# EAGLE design DAC2 (EAGLE 7.2.0)
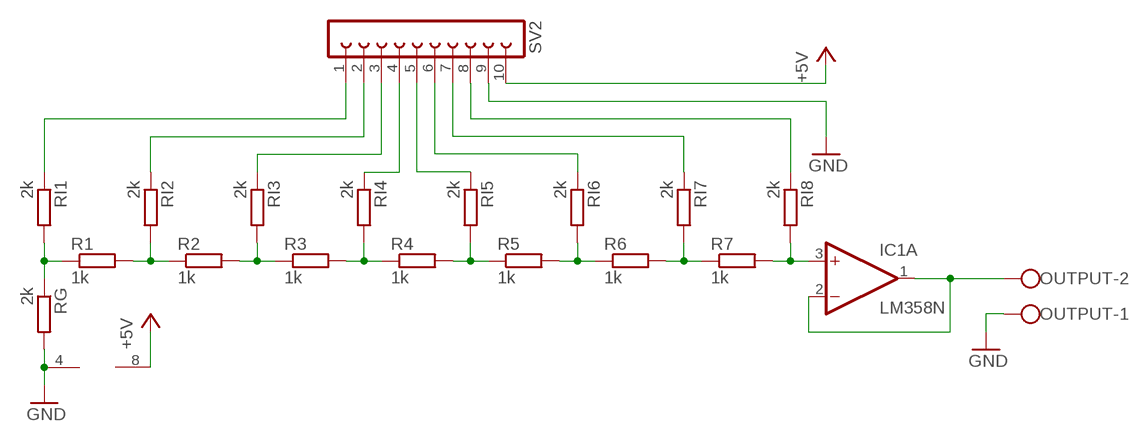
[diagram p0: schematic, sheet 1]

## Parts
IC1  LM358N  [DIL08]
OUTPUT  W237-102  [W237-102]
R1  1k  R-EU_0207/12  [0207/12]
R2  1k  R-EU_0207/12  [0207/12]
R3  1k  R-EU_0207/12  [0207/12]
R4  1k  R-EU_0207/12  [0207/12]
R5  1k  R-EU_0207/12  [0207/12]
R6  1k  R-EU_0207/12  [0207/12]
R7  1k  R-EU_0207/12  [0207/12]
RG  2k  R-EU_0207/12  [0207/12]
RI1  2k  R-EU_0207/12  [0207/12]
RI2  2k  R-EU_0207/12  [0207/12]
RI3  2k  R-EU_0207/12  [0207/12]
RI4  2k  R-EU_0207/12  [0207/12]
RI5  2k  R-EU_0207/12  [0207/12]
RI6  2k  R-EU_0207/12  [0207/12]
RI7  2k  R-EU_0207/12  [0207/12]
RI8  2k  R-EU_0207/12  [0207/12]
SV2  FE10-1  [FE10]

## Nets
+5V: IC1.8(P:V+) SV2.10
GND: IC1.4(P:V-) OUTPUT.1 RG.2 SV2.9
N$1: R1.1 RG.1 RI1.2
N$2: R1.2 R2.1 RI2.2
N$3: R2.2 R3.1 RI3.2
N$4: R3.2 R4.1 RI4.2
N$5: R4.2 R5.1 RI5.2
N$6: R5.2 R6.1 RI6.2
N$7: R6.2 R7.1 RI7.2
N$8: IC1.3(A:+IN) R7.2 RI8.2
N$9: IC1.1(A:OUT) IC1.2(A:-IN) OUTPUT.2
N$10: RI1.1 SV2.1
N$11: RI2.1 SV2.2
N$12: RI3.1 SV2.3
N$13: RI4.1 SV2.4
N$14: RI5.1 SV2.5
N$15: RI6.1 SV2.6
N$16: RI7.1 SV2.7
N$17: RI8.1 SV2.8
Unconnected: IC1.5(B:+IN) IC1.6(B:-IN) IC1.7(B:OUT)

## Library data of the parts
IC1 = linear:LM358: OP AMP also LM158; LM258; LM2904 Source: http://cache.national.com/ds/LM/LM158.pdf
OUTPUT = con-wago-500:W237-102: WAGO SCREW CLAMP; MPN: 237-102; OC_FARNELL: unknown; OC_NEWARK: 70K9898
R1-R7 RG RI1-RI8 = rcl:R-EU_: RESISTOR, European symbol
SV2 = con-lsta:FE10-1: FEMALE HEADER; OC_FARNELL: unknown; OC_NEWARK: unknown

## Board
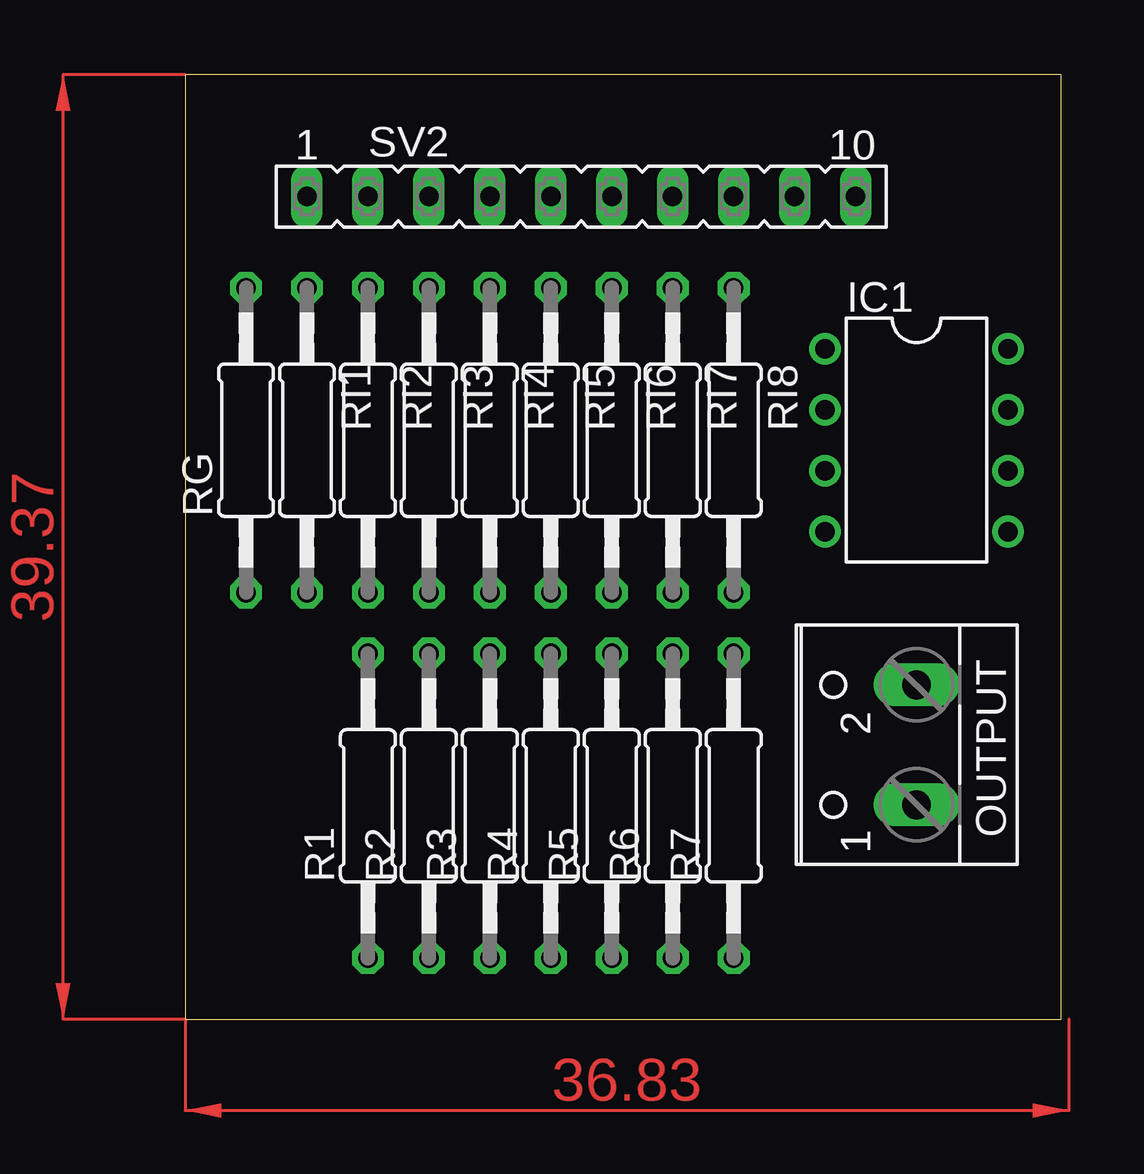
[diagram p1: board, top side]
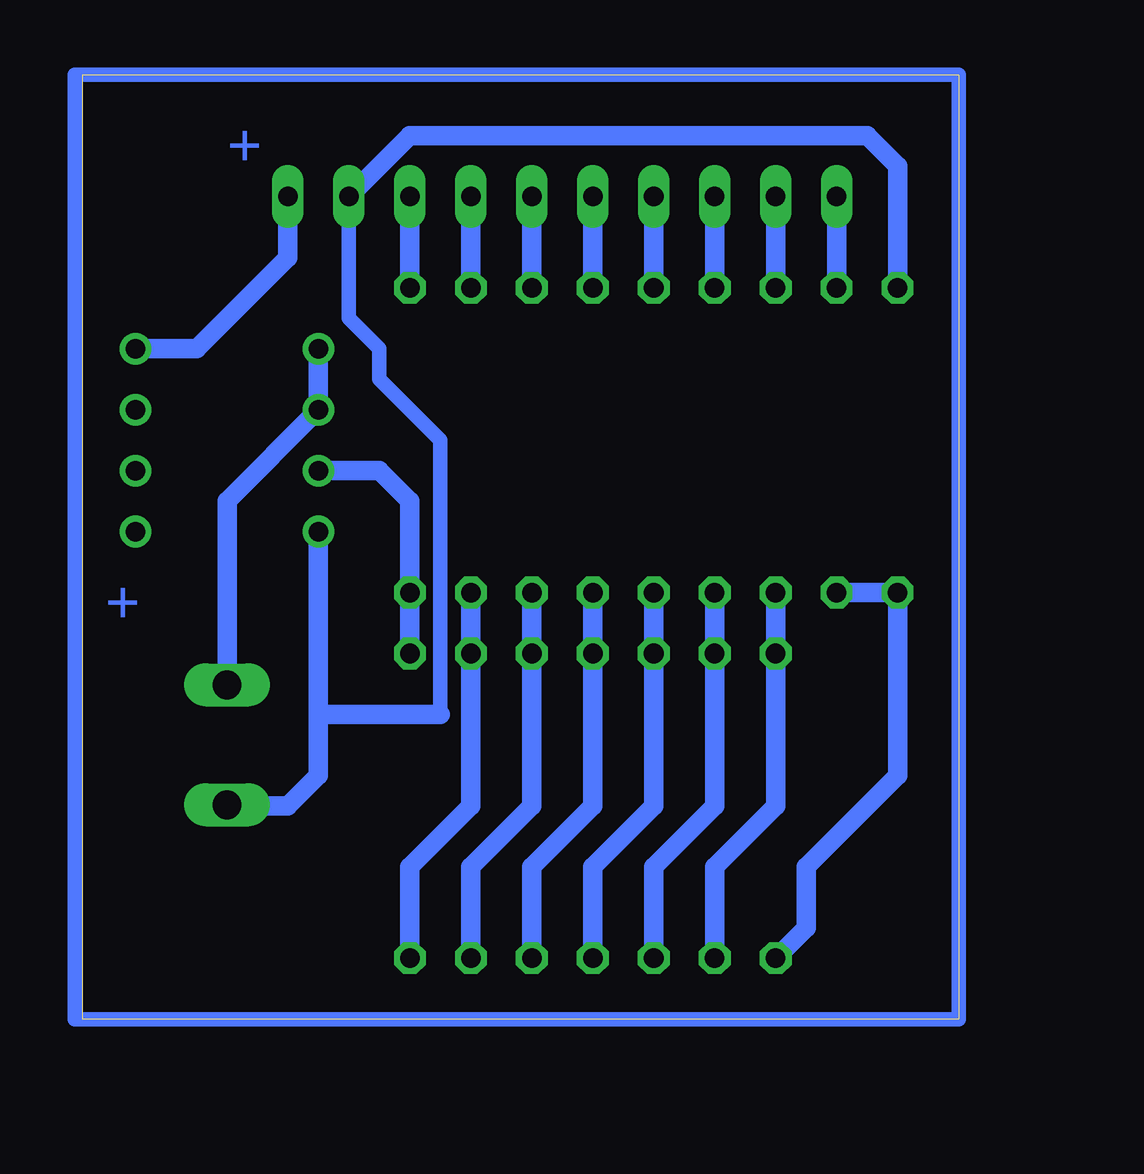
[diagram p2: board, bottom side, seen from below]

Size 36.5 x 39.36 mm. Coordinates in mm from the lower left corner, seen from the top.
Outline: 0,0 36.5,0 36.5,39.36 0,39.36 0,0
Copper layers (1*16): Top 0.035mm / dielectric 1.5mm / Bottom 0.035mm
Design rules "default": minimum track width 10mil, minimum drill 24mil, track to track 8mil, track to pad 8mil, pad to pad 8mil, via to via 8mil, smd to smd 8mil, copper to edge 40mil, drill to drill 8mil, minimum pad ring 10mil, minimum via ring 8mil, stop-mask expansion 4mil, vias tented up to drill 0mil, thermal gap 10mil

### Footprints (pad centres in the part's own frame; a part is rotated, then mirrored left to right if it is on the bottom)
DIL08 = drill 0.813 pad 1.27: 1 -3.81,-3.81; 2 -1.27,-3.81; 3 1.27,-3.81; 4 3.81,-3.81; 5 3.81,3.81; 6 1.27,3.81; 7 -1.27,3.81; 8 -3.81,3.81
W237-102 = drill 1.194 long: 1 -2.5,-1.27; 2 2.5,-1.27
0207/12 = drill 0.813 octagon: 1 -6.35,0; 2 6.35,0
FE10 = drill 0.813 long: 1 -11.43,0; 2 -8.89,0; 3 -6.35,0; 4 -3.81,0; 5 -1.27,0; 6 1.27,0; 7 3.81,0; 8 6.35,0; 9 8.89,0; 10 11.43,0

### Placement (x,y rotation side)
IC1  30.48,24.13 270 top
OUTPUT  29.21,11.43 90 top
R1  7.62,8.89 90 top
R2  10.16,8.89 90 top
R3  12.7,8.89 90 top
R4  15.24,8.89 90 top
R5  17.78,8.89 90 top
R6  20.32,8.89 90 top
R7  22.86,8.89 90 top
RG  2.54,24.13 90 top
RI1  5.08,24.13 270 top
RI2  7.62,24.13 270 top
RI3  10.16,24.13 270 top
RI4  12.7,24.13 270 top
RI5  15.24,24.13 270 top
RI6  17.78,24.13 270 top
RI7  20.32,24.13 270 top
RI8  22.86,24.13 270 top
SV2  16.51,34.29 0 top

### Tracks (layer width: path | path; a pad name or v marks a point on that pad's centre or on a via)
+5V
  Bottom 0.813: IC1.8 31.75,27.94 27.94,31.75 SV2.10
GND
  Bottom 0.61: SV2.9 25.4,29.21 24.13,27.94 24.13,26.67 21.59,24.13 21.59,12.7
  Bottom 0.813: RG.2 2.54,35.56 3.81,36.83 22.86,36.83 SV2.9 | IC1.4 26.67,12.7 | 26.67,12.7 26.67,10.16 27.94,8.89 30.44,8.89 OUTPUT.1 | 21.59,12.7 26.67,12.7
N$1
  Bottom 0.813: RI1.2 RG.1 2.54,10.16 6.35,6.35 6.35,3.81 R1.1
N$2
  Bottom 0.813: R2.1 10.16,6.35 7.62,8.89 R1.2 RI2.2
N$3
  Bottom 0.813: R3.1 12.7,6.35 10.16,8.89 R2.2 RI3.2
N$4
  Bottom 0.813: R4.1 15.24,6.35 12.7,8.89 R3.2 RI4.2
N$5
  Bottom 0.813: R5.1 17.78,6.35 15.24,8.89 R4.2 RI5.2
N$6
  Bottom 0.813: R6.1 20.32,6.35 17.78,8.89 R5.2 RI6.2
N$7
  Bottom 0.813: R7.1 22.86,6.35 20.32,8.89 R6.2 RI7.2
N$8
  Bottom 0.813: R7.2 RI8.2 22.86,21.59 24.13,22.86 IC1.3
N$9
  Bottom 0.813: OUTPUT.2 30.48,21.59 IC1.2 IC1.1
N$10
  Bottom 0.813: SV2.1 RI1.1
N$11
  Bottom 0.813: SV2.2 RI2.1
N$12
  Bottom 0.813: SV2.3 RI3.1
N$13
  Bottom 0.813: SV2.4 RI4.1
N$14
  Bottom 0.813: SV2.5 RI5.1
N$15
  Bottom 0.813: SV2.6 RI6.1
N$16
  Bottom 0.813: RI7.1 SV2.7
N$17
  Bottom 0.813: RI8.1 SV2.8
N$18
  Bottom 0.61: 36.83,39.37 36.83,0 0,0 0,39.37 36.83,39.37
(copper drawn outside any net)
  shapes: Top area x2

### Text on the board
Bottom: + | +